# Altium schematic sheet DC-Motor-DRV.SchDoc
size Tabloid
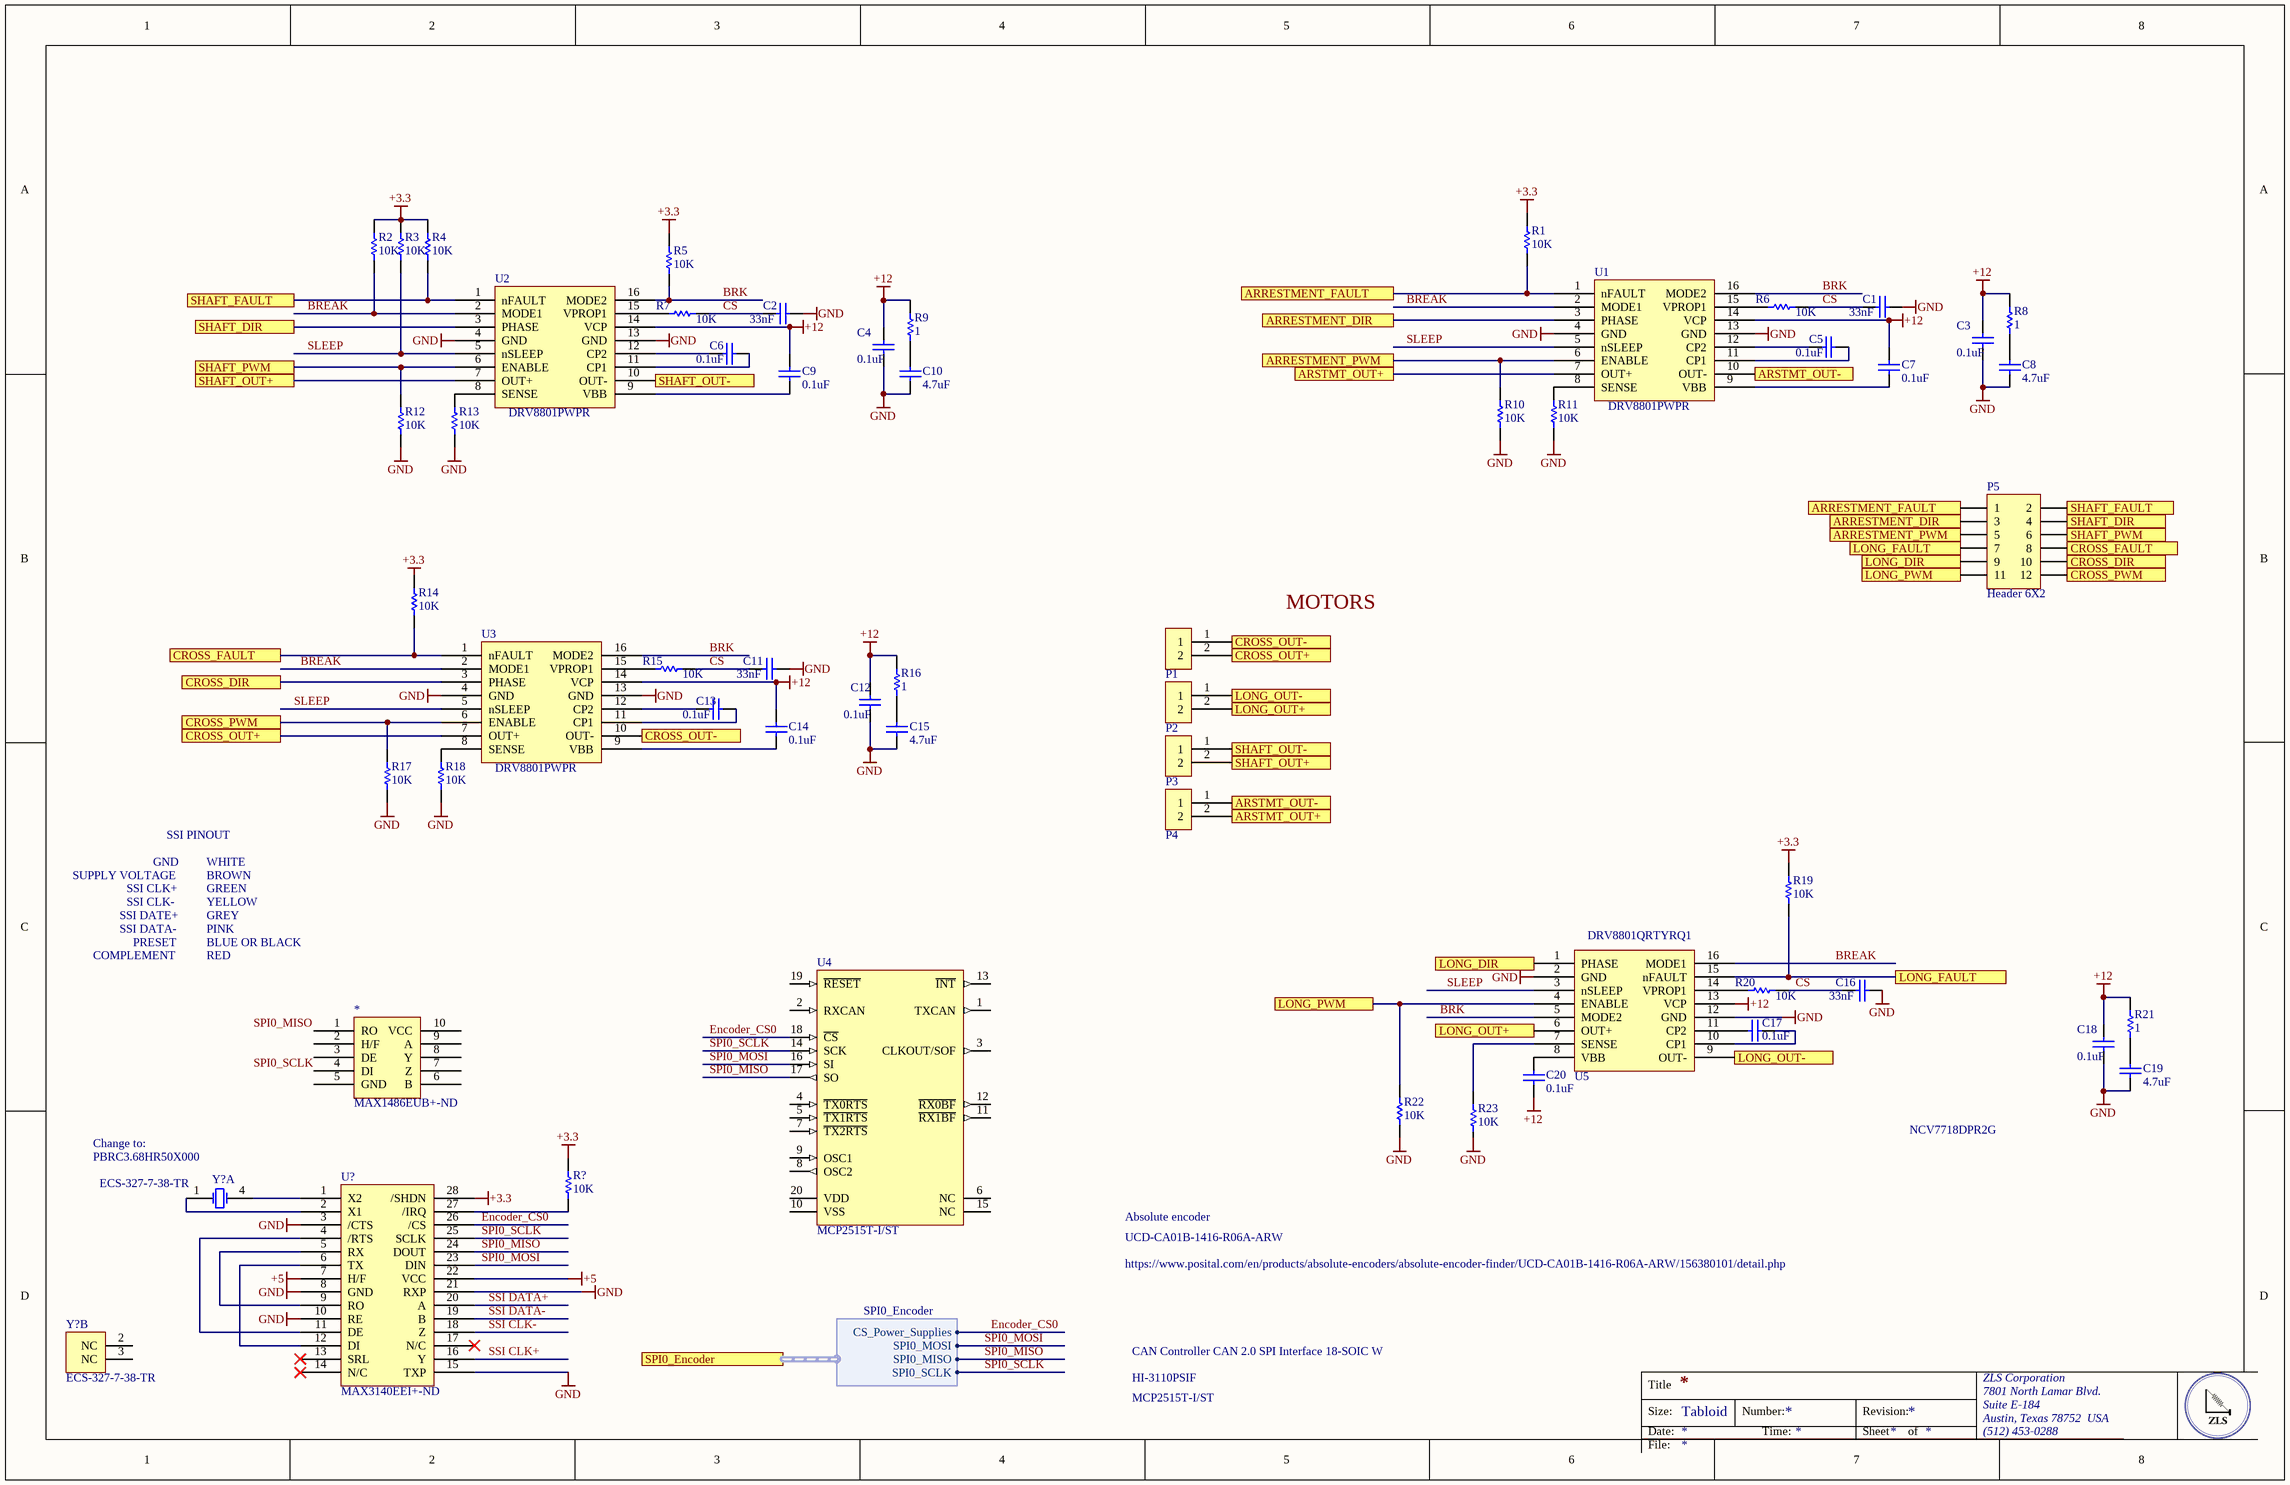
[diagram p0: DC-Motor-DRV.SchDoc]

## Parts
(Parts that share a designator on the sheet are numbered #1, #2 ... from top to bottom, then left to right.)
*  Supplier Part Number 1: MAX1486EUB+-ND  (hidden comment: MAX1486EUB+)
C1  33nF  [CAPC0402(1005)60_L]
C2  33nF  [CAPC0402(1005)60_L]
C3  0.1uF  [CAPC0402(1005)60_L]
C4  0.1uF  [CAPC0402(1005)60_L]
C5  0.1uF  [CAPC0402(1005)60_L]
C6  0.1uF  [CAPC0402(1005)60_L]
C7  0.1uF  [CAPC0402(1005)60_L]
C8  4.7uF  [CAPC0402(1005)60_L]
C9  0.1uF  [CAPC0402(1005)60_L]
C10  4.7uF  [CAPC0402(1005)60_L]
C11  33nF  [CAPC0402(1005)60_L]
C12  0.1uF  [CAPC0402(1005)60_L]
C13  0.1uF  [CAPC0402(1005)60_L]
C14  0.1uF  [CAPC0402(1005)60_L]
C15  4.7uF  [CAPC0402(1005)60_L]
C16  33nF  [CAPC0402(1005)60_L]
C17  0.1uF  [CAPC0402(1005)60_L]
C18  0.1uF  [CAPC0402(1005)60_L]
C19  4.7uF  [CAPC0402(1005)60_L]
C20  0.1uF  [CAPC0402(1005)60_L]
P1  IPL1-102-01-F-S-RA-K  [IPL1-102-01-F-S-RA-K]  (value not drawn)
P2  IPL1-102-01-F-S-RA-K  [IPL1-102-01-F-S-RA-K]  (value not drawn)
P3  IPL1-102-01-F-S-RA-K  [IPL1-102-01-F-S-RA-K]  (value not drawn)
P4  IPL1-102-01-F-S-RA-K  [IPL1-102-01-F-S-RA-K]  (value not drawn)
P5  Header 6X2  [HDR2X6]
R1  10K  [RESC0402(1005)_M]
R2  10K  [RESC0402(1005)_M]
R3  10K  [RESC0402(1005)_M]
R4  10K  [RESC0402(1005)_M]
R5  10K  [RESC0402(1005)_M]
R6  10K  [RESC0402(1005)_M]
R7  10K  [RESC0402(1005)_M]
R8  1  [RESC0402(1005)_M]
R9  1  [RESC0402(1005)_M]
R10  10K  [RESC0402(1005)_M]
R11  10K  [RESC0402(1005)_M]
R12  10K  [RESC0402(1005)_M]
R13  10K  [RESC0402(1005)_M]
R14  10K  [RESC0402(1005)_M]
R15  10K  [RESC0402(1005)_M]
R16  1  [RESC0402(1005)_M]
R17  10K  [RESC0402(1005)_M]
R18  10K  [RESC0402(1005)_M]
R19  10K  [RESC0402(1005)_M]
R20  10K  [RESC0402(1005)_M]
R21  1  [RESC0402(1005)_M]
R22  10K  [RESC0402(1005)_M]
R23  10K  [RESC0402(1005)_M]
R?  10K  [RESC0402(1005)_M]
U1  DRV8801PWPR  [DRV8801PWPR]
U2  DRV8801PWPR  [DRV8801PWPR]
U3  DRV8801PWPR  [DRV8801PWPR]
U4  MCP2515T-I/ST  [TSSOP-ST20_M]
U5  DRV8801QRTYRQ1  [DRV8801QRTYRQ1]
U?  Supplier Part Number 1: MAX3140EEI+-ND  (hidden comment: MAX3140EEI+)
Y?#1  ECS-327-7-38-TR  [ECS-ECX-71-4_V]  (part A of 2)
Y?#2  ECS-327-7-38-TR  [ECS-ECX-71-4_V]  (part B of 2)

## Ports
ARRESTMENT_DIR, ARRESTMENT_FAULT, ARRESTMENT_PWM, ARSTMT_OUT+, ARSTMT_OUT-, CROSS_DIR, CROSS_FAULT, CROSS_OUT+, CROSS_OUT-, CROSS_PWM, LONG_DIR, LONG_FAULT, LONG_OUT+, LONG_OUT-, LONG_PWM, SHAFT_DIR, SHAFT_FAULT, SHAFT_OUT+, SHAFT_OUT-, SHAFT_PWM, SPI0_Encoder (harness SPI0_Encoder)

## Harnesses
SPI0_Encoder: CS_Power_Supplies, SPI0_MOSI, SPI0_MISO, SPI0_SCLK

## Nets
+3.3: R1.2 R2.2 R3.2 R4.2 R5.2 R19.2 R?.2 U?.28(/SHDN)
+5: U?.7(H/F) U?.22(VCC)
+12: C3.2 C4.2 C7.2 C9.2 C12.2 C14.2 C18.2 C20.1 R8.2 R9.2 R16.2 R21.2 U1.14(VCP) U2.14(VCP) U3.14(VCP) U5.13(VCP)
GND: C1.2 C2.2 C3.1 C4.1 C8.1 C10.1 C11.2 C12.1 C15.1 C16.2 C18.1 C19.1 R10.1 R11.1 R12.1 R13.1 R17.1 R18.1 R22.1 U1.4(GND) U1.13(GND) U2.4(GND) U2.13(GND) U3.4(GND) U3.13(GND) U5.2(GND) U5.12(GND) U?.3(/CTS) U?.8(GND) U?.10(RE) U?.15(TXP) U?.21(RXP)
ARRESTMENT_DIR: P5.3 U1.3(PHASE) ; port ARRESTMENT_DIR
ARRESTMENT_FAULT: P5.1 R1.1 U1.1(nFAULT) ; port ARRESTMENT_FAULT
ARRESTMENT_PWM: P5.5 R10.2 U1.6(ENABLE) ; port ARRESTMENT_PWM
ARSTMT_OUT+: P4.2 U1.7(OUT+) ; port ARSTMT_OUT+
ARSTMT_OUT-: P4.1 U1.10(OUT-) ; port ARSTMT_OUT-
BREAK: R2.1 U1.2(MODE1) U2.2(MODE1) U3.2(MODE1) U5.16(MODE1)
BRK: R5.1 U1.16(MODE2) U2.16(MODE2) U3.16(MODE2) U5.5(MODE2)
CROSS_DIR: P5.10 U3.3(PHASE) ; port CROSS_DIR
CROSS_FAULT: P5.8 R14.1 U3.1(nFAULT) ; port CROSS_FAULT
CROSS_OUT+: P1.2 U3.7(OUT+) ; port CROSS_OUT+
CROSS_OUT-: P1.1 U3.10(OUT-) ; port CROSS_OUT-
CROSS_PWM: P5.12 R17.2 U3.6(ENABLE) ; port CROSS_PWM
CS: C1.1 C2.1 C11.1 C16.1 R6.2 R7.2 R15.2 R20.2
Encoder_CS0: U4.18(~{CS}) U?.26(/CS) ; port SPI0_Encoder.CS_Power_Supplies
LONG_DIR: P5.9 U5.1(PHASE) ; port LONG_DIR
LONG_FAULT: P5.7 R19.1 U5.15(nFAULT) ; port LONG_FAULT
LONG_OUT+: P2.2 U5.6(OUT+) ; port LONG_OUT+
LONG_OUT-: P2.1 U5.9(OUT-) ; port LONG_OUT-
LONG_PWM: P5.11 R22.2 U5.4(ENABLE) ; port LONG_PWM
SHAFT_DIR: P5.4 U2.3(PHASE) ; port SHAFT_DIR
SHAFT_FAULT: P5.2 R4.1 U2.1(nFAULT) ; port SHAFT_FAULT
SHAFT_OUT+: P3.2 U2.7(OUT+) ; port SHAFT_OUT+
SHAFT_OUT-: P3.1 U2.10(OUT-) ; port SHAFT_OUT-
SHAFT_PWM: P5.6 R12.2 U2.6(ENABLE) ; port SHAFT_PWM
SLEEP: R3.1 U1.5(nSLEEP) U2.5(nSLEEP) U3.5(nSLEEP) U5.3(nSLEEP)
SPI0_MISO: U4.17(SO) U?.24(DOUT) ; port SPI0_Encoder.SPI0_MISO
SPI0_MOSI: U4.16(SI) U?.23(DIN) ; port SPI0_Encoder.SPI0_MOSI
SPI0_SCLK: U4.14(SCK) U?.25(SCLK) ; port SPI0_Encoder.SPI0_SCLK
SSI CLK+: U?.16(Y)
SSI CLK-: U?.18(Z)
SSI DATA+: U?.20(A)
SSI DATA-: U?.19(B)
NetC5_1: C5.1 U1.11(CP1)
NetC5_2: C5.2 U1.12(CP2)
NetC6_1: C6.1 U2.11(CP1)
NetC6_2: C6.2 U2.12(CP2)
NetC7_1: C7.1 U1.9(VBB)
NetC8_2: C8.2 R8.1
NetC9_1: C9.1 U2.9(VBB)
NetC10_2: C10.2 R9.1
NetC13_1: C13.1 U3.11(CP1)
NetC13_2: C13.2 U3.12(CP2)
NetC14_1: C14.1 U3.9(VBB)
NetC15_2: C15.2 R16.1
NetC17_1: C17.1 U5.10(CP1)
NetC17_2: C17.2 U5.11(CP2)
NetC19_2: C19.2 R21.1
NetC20_2: C20.2 U5.8(VBB)
NetR6_1: R6.1 U1.15(VPROP1)
NetR7_1: R7.1 U2.15(VPROP1)
NetR11_2: R11.2 U1.8(SENSE)
NetR13_2: R13.2 U2.8(SENSE)
NetR15_1: R15.1 U3.15(VPROP1)
NetR18_2: R18.2 U3.8(SENSE)
NetR20_1: R20.1 U5.14(VPROP1)
NetR23_2: R23.2 U5.7(SENSE)
NetR?_1: R?.1 U?.27(/IRQ)
NetU?_1: U?.1(X2) Y?#1.4(X2)
NetU?_2: U?.2(X1) Y?#1.1(X1)
NetU?_4: U?.4(/RTS) U?.11(DE)
NetU?_5: U?.5(RX) U?.9(RO)
NetU?_6: U?.6(TX) U?.12(DI)

Not connected (* = marked no-connect by the designer): * 1(RO) 2(H/F) 3(DE) 4(DI) 5(GND) 6(B) 7(Z) 8(Y) 9(A) 10(VCC); R14 2; R23 1; U4 1(TXCAN) 2(RXCAN) 3(CLKOUT/SOF) 4(~{TX0RTS}) 5(~{TX1RTS}) 6(NC) 7(~{TX2RTS}) 8(OSC2) 9(OSC1) 10(VSS) 11(~{RX1BF}) 12(~{RX0BF}) 13(~{INT}) 15(NC) 19(~{RESET}) 20(VDD); U? 13(SRL)* 14(N/C)* 17(N/C)*; Y?#2 2(NC) 3(NC)

## Notes on the sheet
- MOTORS
- SSI PINOUT
- SUPPLY VOLTAGE
- SSI CLK+
- GND
- WHITE
- BROWN
- GREEN
- COMPLEMENT
- SSI DATE+
- SSI DATA-
- SSI CLK-
- PRESET
- YELLOW
- GREY
- PINK
- BLUE OR BLACK
- RED
- Change to:
- (near Y?#1) PBRC3.68HR50X000
- NCV7718DPR2G
- Absolute encoder
- UCD-CA01B-1416-R06A-ARW
- https://www.posital.com/en/products/absolute-encoders/absolute-encoder-finder/UCD-CA01B-1416-R06A-ARW/156380101/detail.php
- CAN Controller CAN 2.0 SPI Interface 18-SOIC W
- HI-3110PSIF
- MCP2515T-I/ST
- Labels drawn without touching a wire or pin: +3.3, GND, SPI0_MISO, SPI0_SCLK
- Title
- Size:
- Date:
- Tabloid
- Number:
- Time:
- Revision:
- Sheet
- of
- ZLS Corporation
- 7801 North Lamar Blvd.
- Suite E-184
- Austin, Texas 78752  USA
- (512) 453-0288
- File:

## Library data of the parts
C1-C20 = CMP-1034-00252-1: CAP CER 0.1UF 10V X7R 0402; Manufacturer: Murata Electronics North America; Manufacturer Part Number: GRM155R71A104KA01D; Tolerance: ±10%; Supplier 1: Digi-Key; Supplier Part Number 1: 490-6321-1-ND; RoHS: RoHS Compliant; Category: Capacitors; Stock 1: 2920395; Pricing 1: 1=0.1, 10=0.014, 100=0.0063, 500=0.00446, 1000=0.00351, 2500=0.00319, 5000=0.00293 (USD); Packaging: Cut Tape (CT); Part Status: Active; Voltage - Rated: 10V; Temperature Coefficient: X7R; Operating Temperature: -55°C ~ 125°C; Features: -; Ratings: -; Applications: General Purpose; Mounting Type: Surface Mount, MLCC; Package / Case: 0402 (1005 Metric); Size / Dimension: 0.039" L x 0.020" W (1.00mm x 0.50mm); Height - Seated (Max): -; Thickness (Max): 0.022" (0.55mm); Lead Spacing: -; ComponentLink1URL: http://www.murata.com/~/media/webrenewal/support/library/catalog/products/capacitor/mlcc/c02e.ashx?la=en-us; ComponentLink1Description: http://www.murata.com/~/media/webrenewal/support/library/catalog/products/capacitor/mlcc/c02e.ashx?la=en-us
P5 = Header 6X2: Header, 6-Pin, Dual row; LatestRevisionDate: 17-Jul-2002; LatestRevisionNote: Re-released for DXP Platform.; Publisher: Altium Limited
R1-R23 R? = CMP-1011-00651-1
U1-U3 = DRV8801PWPR: Manufacturer: Texas Instruments; Motor Type - Stepper: Bipolar; Motor Type - AC, DC: Brushed DC; Function: Driver - Fully Integrated, Control and Power Stage; Output Configuration: Half Bridge (2); Interface: Parallel; Current - Output: 2.8A; Voltage - Supply: 8 V ~ 38 V; Supplier 1: Digi-Key; Supplier Part Number 1: 296-25378-1-ND; Manufacturer Part Number: DRV8801PWPR; RoHS: RoHS Compliant; Category: Integrated Circuits (ICs); Stock 1: 40424; Pricing 1: 1=2.37, 10=2.126, 100=1.709, 500=1.40414, 1000=1.16344 (USD); Packaging: Cut Tape (CT); Part Status: Active; Technology: DMOS; Step Resolution: -; Applications: General Purpose; Voltage - Load: 8 V ~ 38 V; Operating Temperature: -40°C ~ 150°C (TJ); Mounting Type: Surface Mount; Package / Case: 16-TSSOP (0.173", 4.40mm Width) Exposed Pad; Supplier Device Package: 16-HTSSOP; Base Part Number: DRV8801; ComponentLink1URL: http://www.ti.com/lit/ds/symlink/drv8801.pdf; ComponentLink1Description: http://www.ti.com/lit/ds/symlink/drv8801.pdf
U4 = CMP-0186-00079-2: Stand-Alone CAN Controller With SPI Interface, 20-Pin TSSOP, Industrial Temperature, Tape and Reel; RevisionNote: URLs added. DatasheetVersion updated.; PackageVersion: revBB, Aug-2009; Code_JEDEC: MO-153-AC; ComponentLink1URL: http://www.microchip.com/; ComponentLink3URL: http://www.microchip.com/stellent/groups/techpub_sg/documents/packagingspec/en012702.pdf; PackageReference: TSSOP-ST20; ComponentLink2URL: http://ww1.microchip.com/downloads/en/DeviceDoc/21801f.pdf; ComponentLink1Description: Manufacturer URL; DatasheetVersion: revF, Oct-2010; PackageDescription: 20-Lead Plastic Thin Shrink Small Outline (ST) - 4.4mm Body [TSSOP]; ComponentLink2Description: Datasheet; ComponentLink3Description: Package Specification
U5 = DRV8801QRTYRQ1: Manufacturer: Texas Instruments; Motor Type - Stepper: Bipolar; Motor Type - AC, DC: Brushed DC; Function: Driver - Fully Integrated, Control and Power Stage; Output Configuration: Half Bridge (2); Interface: Parallel; Current - Output: 2.8A; Voltage - Supply: 8 V ~ 38 V; Supplier 1: Digi-Key; Supplier Part Number 1: 296-36582-1-ND; Manufacturer Part Number: DRV8801QRTYRQ1; RoHS: RoHS Compliant; Category: Integrated Circuits (ICs); Stock 1: 3214; Pricing 1: 1=3.31, 10=2.976, 100=2.4383, 500=2.0757, 1000=1.75059 (USD); Packaging: Cut Tape (CT); Part Status: Active; Technology: DMOS; Step Resolution: -; Applications: General Purpose; Voltage - Load: 8 V ~ 38 V; Operating Temperature: -40°C ~ 150°C (TJ); Mounting Type: Surface Mount; Package / Case: 16-WQFN Exposed Pad; Supplier Device Package: 16-QFN (3x4); Base Part Number: DRV8801; ComponentLink1URL: http://www.ti.com/lit/ds/symlink/drv8801-q1.pdf; ComponentLink1Description: http://www.ti.com/lit/ds/symlink/drv8801-q1.pdf
Y?#1 Y?#2 = CMP-0307-00001-2: Crystal, Frequency 32.768 kHz, Body 7x1.5 mm; Manufacturer: ECS; Frequency Tolerance: 20 ppm; ComponentLink1URL: http://www.ecsxtal.com/; Mounting Technology: Surface Mount; Storage Temperature: -55 to 125 degC; ComponentLink1Description: Manufacturer URL; PackageDescription: 4-Pin SMT Crystal, 7 x 1.5 mm Body; Nominal Frequency: 32.768 KHz; PartNumber: ECS-327-7-38-TR; PackageReference: ECX-71; PartId: 1
* = MAX1486EUB+: Supplier 1: Digi-Key
U? = MAX3140EEI+: Supplier 1: Digi-Key